# Altium project Visual_tactile.PrjPcb (part 1 of 3)
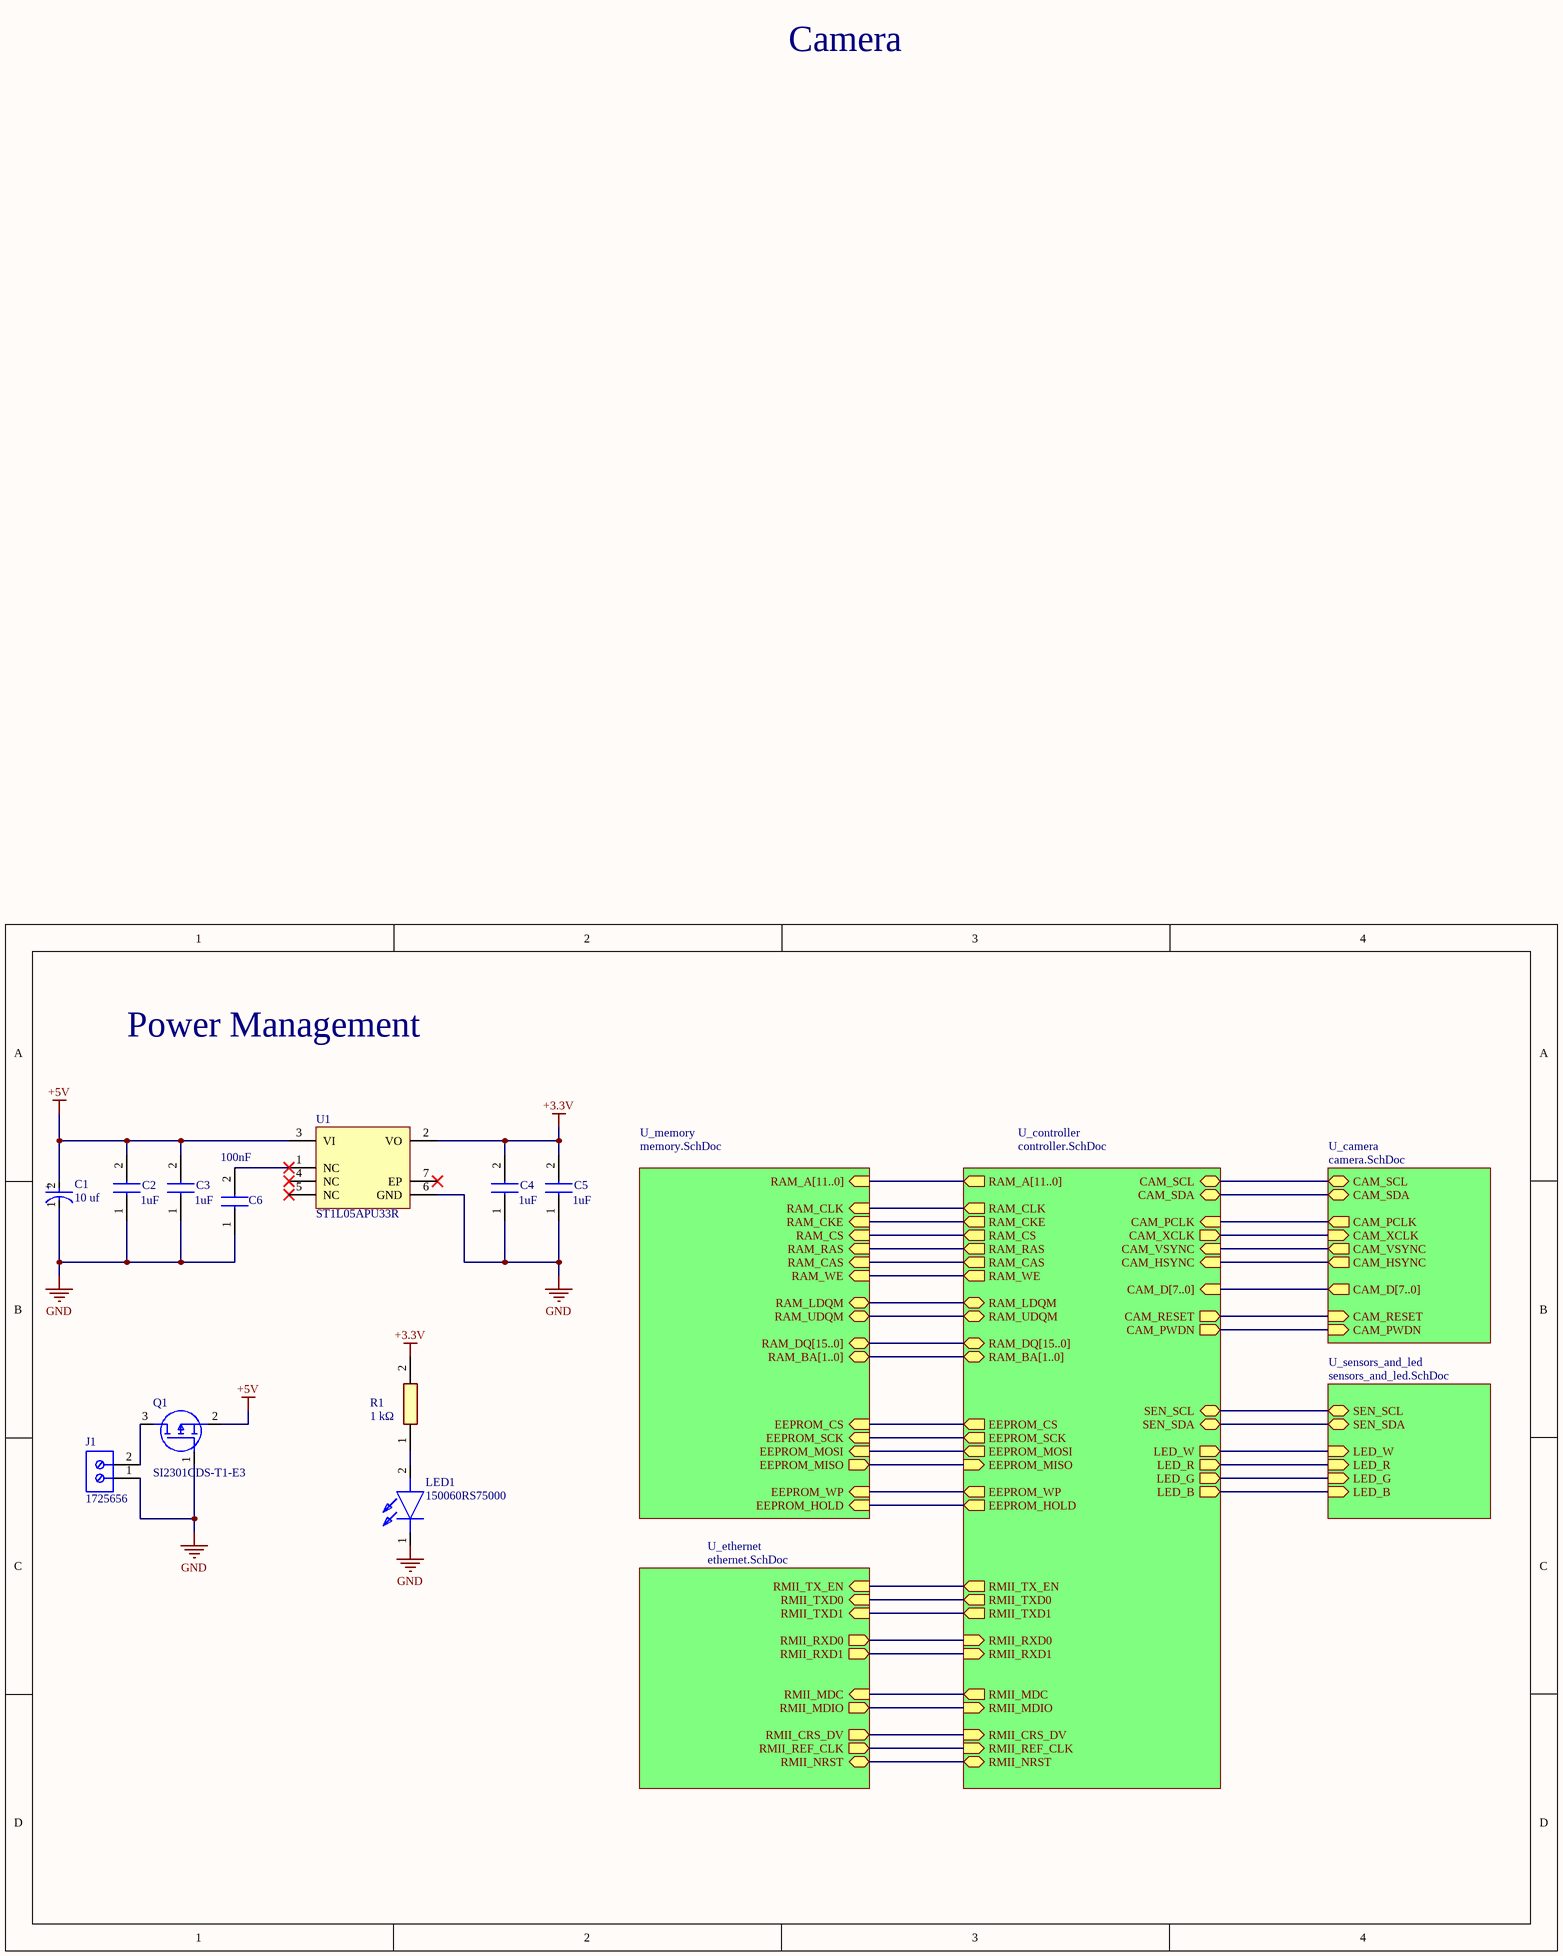
[diagram p0: visual_tactile.SchDoc]
6 sheets, 169 parts. Net scope: hierarchical (ports join the sheet entries above them; power ports are global).
Board file: visual_tactile.PcbDoc
Sheets:
  visual_tactile.SchDoc
    U_controller = controller.SchDoc
    U_ethernet = ethernet.SchDoc
    U_camera = camera.SchDoc
    U_sensors_and_led = sensors_and_led.SchDoc
    U_memory = memory.SchDoc

## Sheet visual_tactile.SchDoc
size A4; SheetNumber: 1; SheetTotal: 6

### Parts
C1  10 uf  [FP-T491D-MFG]
C2  value 1uF  [CAPC1608X87N]
C3  value 1uF  [CAPC1608X87N]
C4  value 1uF  [CAPC1608X87N]
C5  value 1uF  [CAPC1608X87N]
C6  value 100nF  [CAPC1608X87N]  (hidden comment: CGA3E2X7R1H104K080AA)
J1  1725656  [PHOE-1725656-2]
LED1  150060RS75000  [LEDC1608X80N]
Q1  SI2301CDS-T1-E3  [SOT95P237X112-3N]
R1  1 kΩ  [RESC1005X35N]
U1  ST1L05APU33R  [DFN6D_M]

### Sub-sheets
U_camera = camera.SchDoc: CAM_SCL (bidir), CAM_SDA (bidir), CAM_RESET (in), CAM_PCLK (out), CAM_HSYNC (out), CAM_VSYNC (out), CAM_D[7..0] (out), CAM_XCLK (in), CAM_PWDN (in)
U_controller = controller.SchDoc: CAM_D[7..0] (in), CAM_PCLK (in), CAM_VSYNC (in), CAM_XCLK (out), CAM_HSYNC (in), CAM_SCL (bidir), CAM_SDA (bidir), CAM_RESET (out), CAM_PWDN (out), SEN_SCL (bidir), SEN_SDA (bidir), EEPROM_CS (out), EEPROM_SCK (out), EEPROM_MOSI (out), EEPROM_WP (out), EEPROM_HOLD (out), EEPROM_MISO (in), RAM_A[11..0] (out), RAM_DQ[15..0] (bidir), RAM_BA[1..0] (bidir), RAM_CLK (out), RAM_CKE (out), RAM_CS (out), RAM_RAS (out), RAM_CAS (out), RAM_WE (out), RAM_LDQM (bidir), RAM_UDQM (bidir), RMII_TX_EN (out), RMII_TXD0 (out), RMII_TXD1 (out), RMII_RXD0 (in), RMII_RXD1 (in), RMII_CRS_DV (in), RMII_MDC (out), RMII_MDIO (in), RMII_NRST (bidir), RMII_REF_CLK (in), LED_W (out), LED_R (out), LED_G (out), LED_B (out)
U_ethernet = ethernet.SchDoc: RMII_TX_EN (in), RMII_TXD0 (in), RMII_TXD1 (in), RMII_RXD0 (out), RMII_RXD1 (out), RMII_CRS_DV (out), RMII_MDC (in), RMII_MDIO (out), RMII_NRST (bidir), RMII_REF_CLK (out)
U_memory = memory.SchDoc: EEPROM_CS (in), EEPROM_SCK (in), EEPROM_MOSI (in), EEPROM_WP (in), EEPROM_HOLD (in), EEPROM_MISO (out), RAM_A[11..0] (in), RAM_DQ[15..0] (bidir), RAM_BA[1..0] (bidir), RAM_CLK (in), RAM_CKE (in), RAM_CS (in), RAM_RAS (in), RAM_CAS (in), RAM_WE (in), RAM_LDQM (bidir), RAM_UDQM (bidir)
U_sensors_and_led = sensors_and_led.SchDoc: SEN_SCL (bidir), SEN_SDA (bidir), LED_W (in), LED_R (in), LED_G (in), LED_B (in)

### Nets
+3.3V: C4.2 C5.2 R1.2 U1.2(VO)
+5V: C1.2(A) C2.2 C3.2 Q1.2(S) U1.3(VI)
GND: C1.1(C) C2.1 C3.1 C4.1 C5.1 C6.1 J1.1 LED1.1(K) Q1.1(G) U1.6(GND)
CAM_HSYNC: sheet U_controller/CAM_HSYNC, sheet U_camera/CAM_HSYNC
CAM_PCLK: sheet U_controller/CAM_PCLK, sheet U_camera/CAM_PCLK
CAM_PWDN: sheet U_controller/CAM_PWDN, sheet U_camera/CAM_PWDN
CAM_RESET: sheet U_controller/CAM_RESET, sheet U_camera/CAM_RESET
CAM_SCL: sheet U_controller/CAM_SCL, sheet U_camera/CAM_SCL
CAM_SDA: sheet U_controller/CAM_SDA, sheet U_camera/CAM_SDA
CAM_VSYNC: sheet U_controller/CAM_VSYNC, sheet U_camera/CAM_VSYNC
CAM_XCLK: sheet U_controller/CAM_XCLK, sheet U_camera/CAM_XCLK
EEPROM_CS: sheet U_controller/EEPROM_CS, sheet U_memory/EEPROM_CS
EEPROM_HOLD: sheet U_controller/EEPROM_HOLD, sheet U_memory/EEPROM_HOLD
EEPROM_MISO: sheet U_controller/EEPROM_MISO, sheet U_memory/EEPROM_MISO
EEPROM_MOSI: sheet U_controller/EEPROM_MOSI, sheet U_memory/EEPROM_MOSI
EEPROM_SCK: sheet U_controller/EEPROM_SCK, sheet U_memory/EEPROM_SCK
EEPROM_WP: sheet U_controller/EEPROM_WP, sheet U_memory/EEPROM_WP
NRST: sheet U_controller/RMII_NRST, sheet U_ethernet/RMII_NRST
RAM_CAS: sheet U_controller/RAM_CAS, sheet U_memory/RAM_CAS
RAM_CKE: sheet U_controller/RAM_CKE, sheet U_memory/RAM_CKE
RAM_CLK: sheet U_controller/RAM_CLK, sheet U_memory/RAM_CLK
RAM_CS: sheet U_controller/RAM_CS, sheet U_memory/RAM_CS
RAM_LDQM: sheet U_controller/RAM_LDQM, sheet U_memory/RAM_LDQM
RAM_RAS: sheet U_controller/RAM_RAS, sheet U_memory/RAM_RAS
RAM_UDQM: sheet U_controller/RAM_UDQM, sheet U_memory/RAM_UDQM
RAM_WE: sheet U_controller/RAM_WE, sheet U_memory/RAM_WE
RMII_CRS_DV: sheet U_controller/RMII_CRS_DV, sheet U_ethernet/RMII_CRS_DV
RMII_MDC: sheet U_controller/RMII_MDC, sheet U_ethernet/RMII_MDC
RMII_MDIO: sheet U_controller/RMII_MDIO, sheet U_ethernet/RMII_MDIO
RMII_REF_CLK: sheet U_controller/RMII_REF_CLK, sheet U_ethernet/RMII_REF_CLK
RMII_RXD0: sheet U_controller/RMII_RXD0, sheet U_ethernet/RMII_RXD0
RMII_RXD1: sheet U_controller/RMII_RXD1, sheet U_ethernet/RMII_RXD1
RMII_TX_EN: sheet U_controller/RMII_TX_EN, sheet U_ethernet/RMII_TX_EN
RMII_TXD0: sheet U_controller/RMII_TXD0, sheet U_ethernet/RMII_TXD0
RMII_TXD1: sheet U_controller/RMII_TXD1, sheet U_ethernet/RMII_TXD1
SEN_SCL: sheet U_controller/SEN_SCL, sheet U_sensors_and_led/SEN_SCL
SEN_SDA: sheet U_controller/SEN_SDA, sheet U_sensors_and_led/SEN_SDA
NetC6_2: C6.2 U1.1(NC)
NetJ1_2: J1.2 Q1.3(D)
NetLED1_2: LED1.2(A) R1.1
NetR41_1: sheet U_controller/LED_W, sheet U_sensors_and_led/LED_W
NetR42_1: sheet U_controller/LED_R, sheet U_sensors_and_led/LED_R
NetR43_1: sheet U_controller/LED_G, sheet U_sensors_and_led/LED_G
NetR44_1: sheet U_controller/LED_B, sheet U_sensors_and_led/LED_B

Not connected (* = marked no-connect by the designer): U1 4(NC)* 5(NC)* 7(EP)*

### Buses and harness runs
bus sheet U_camera/CAM_D[7..0] = sheet U_controller/CAM_D[7..0]
bus sheet U_controller/RAM_A[11..0] = sheet U_memory/RAM_A[11..0]
bus sheet U_controller/RAM_BA[1..0] = sheet U_memory/RAM_BA[1..0]
bus sheet U_controller/RAM_DQ[15..0] = sheet U_memory/RAM_DQ[15..0]

### Notes on the sheet
- Camera
- Power Management
- (in symbol CMP-2000-07200-2) +

### Library data of the parts
C1 = CMP-2000-07200-2: CAP TANT 10UF 10% 25V 2917; Tolerance: 20%; Life (Hours): 2000Hour; Dielectric Material: Tantalum; Dissipation Factor: 6%; Leakage Current: 2.5uA; Ripple Current: 387mA; Polarity: Polar; ESR (Equivalent Series Resistance): 1R; Voltage: 25V; Capacitance: 10uF; Voltage Rating: 25V; Voltage Rating (DC): 25V; Depth: 4.3mm; Mount: Surface Mount; Length: 7.3mm; Termination: SMD/SMT; Radiation Hardening: No; Max Operating Temperature: 125°C; REACH SVHC: No SVHC; Height: 2.8mm; Package Quantity: 1; Packaging: Tape and Reel; Case Code (Imperial): 2917; Width: 4.3mm; Min Operating Temperature: -55°C; Features: General Purpose; Case Code (Metric): 7343; Height - Seated (Max): 0.122inch; Number of Pins: 2; Lead Free: Lead Free; Case/Package: 2917
C2-C5 = C0603C300J5GACTU: Ceramic Capacitor, Multilayer, Ceramic, 10V, 10% +Tol, 10% -Tol, X5R, 15% TC, 1uF, Surface Mount, 0603; Manufacturer_Name: KEMET; Multilayer: Yes; Tolerance  (fill in as +-): 5%; Rated DC Voltage (URdc): 50V; Temperature Characteristics Code: C0G; Datasheet Link: https://content.kemet.com/datasheets/KEM_C1003_C0G_SMD.pdf; Height: 0.87mm; Manufacturer_Part_Number: C0603C300J5GACTU; Mouser Part Number: 80-C0603C300J5G; Mouser Price/Stock: https://www.mouser.co.uk/ProductDetail/KEMET/C0603C300J5GACTU?qs=KQYYlyH3z3RpeXhtJmCcMA%3D%3D; Arrow Part Number: C0603C300J5GACTU; Arrow Price/Stock: https://www.arrow.com/en/products/c0603c300j5gactu/kemet-corporation; Supplier: Mouser; Supplier Part Number: 80-C0603C300J5G; Manufacturer: KEMET; Manufacturer Part Number: C0603C300J5GACTU; RoHS: Yes; Category: Ceramic Capacitors; Stock: 135157; Pricing: 1=0.1, 10=0.032, 50=0.032, 100=0.016, 1000=0.011, 10000=0.008 (USD); Mounting Technology: Surface Mount; Pins: 2; Dielectric Material: Ceramic; Package Shape: Rectangular; Case/Package: 0603; Terminal Finish: Nickel; Min Operating Temperature: -55°C; Max Operating Temperature: 125°C; JESD-609 Code: e3; Capacitor Type: Ceramic; Package Style: SMTMeter; Packaging: Tape and Reel; Tolerance (fill in as +-): 5%; Termination: Wraparound; Length: 1.6mm; Width: 0.8mm; Reach SVHC Compliant: Yes; RoHS Compliant: Yes; ComponentLink1URL: https://datasheet.ciiva.com:443/pdfs/VipMasterIC/IC/KEME/KEME-S-A0005605168/KEME-S-A0005605168-1.pdf?src-supplier=IHS+Markit; ComponentLink1Description: https://datasheet.ciiva.com:443/pdfs/VipMasterIC/IC/KEME/KEME-S-A0005605168/KEME-S-A0005605168-1.pdf?src-supplier=IHS+Markit; ComponentLink2URL: https://datasheet.ciiva.com/22700/1691965-22700853.pdf?src-supplier=Element14; ComponentLink2Description: https://datasheet.ciiva.com/22700/1691965-22700853.pdf?src-supplier=Element14; ComponentLink3URL: https://datasheet.ciiva.com/5420/kem-c1003-c0g-smd-356956-5420875.pdf?src-supplier=Mouser; ComponentLink3Description: https://datasheet.ciiva.com/5420/kem-c1003-c0g-smd-356956-5420875.pdf?src-supplier=Mouser; ComponentLink4URL: https://datasheet.ciiva.com:443/pdfs/VipMasterIC/IC/TDKC/TDKC-S-A0008796792/TDKC-S-A0008796792-1.pdf?src-supplier=IHS+Markit; ComponentLink4Description: https://datasheet.ciiva.com:443/pdfs/VipMasterIC/IC/TDKC/TDKC-S-A0008796792/TDKC-S-A0008796792-1.pdf?src-supplier=IHS+Markit; ComponentLink5URL: https://datasheet.ciiva.com:443/pdfs/VipMasterIC/IC/KEME/KEME-S-A0008991665/KEME-S-A0008991665-1.pdf?src-supplier=IHS+Markit; ComponentLink5Description: https://datasheet.ciiva.com:443/pdfs/VipMasterIC/IC/KEME/KEME-S-A0008991665/KEME-S-A0008991665-1.pdf?src-supplier=IHS+Markit
C6 = C0603C300J5GACTU: Ceramic Capacitor, Multilayer, Ceramic, 50V, 10% +Tol, 10% -Tol, X7R, 15% TC, 0.1uF, Surface Mount, 0603; Manufacturer_Name: KEMET; Manufacturer: TDK; Multilayer: Yes; Reference Standard: AEC-Q200; Datasheet Link: https://content.kemet.com/datasheets/KEM_C1003_C0G_SMD.pdf; Height: 0.87mm; Manufacturer_Part_Number: C0603C300J5GACTU; Mouser Part Number: 80-C0603C300J5G; Mouser Price/Stock: https://www.mouser.co.uk/ProductDetail/KEMET/C0603C300J5GACTU?qs=KQYYlyH3z3RpeXhtJmCcMA%3D%3D; Arrow Part Number: C0603C300J5GACTU; Arrow Price/Stock: https://www.arrow.com/en/products/c0603c300j5gactu/kemet-corporation; Supplier: Rs; Supplier Part Number: 7882985P; Manufacturer Part Number: CGA3E2X7R1H104K080AA; RoHS: Yes; Category: Ceramic Capacitors; Stock: 84850; Pricing: 250=0.042, 500=0.039, 1000=0.037, 2500=0.033 (EUR); Mounting Technology: Surface Mount; Pins: 2; Dielectric Material: Ceramic; Package Shape: Rectangular; Case/Package: 0603; Terminal Finish: Nickel; Min Operating Temperature: -55°C; Max Operating Temperature: 125°C; JESD-609 Code: e3; Capacitor Type: Ceramic; Tolerance  (fill in as +-): 10%; Package Style: SMTMeter; Packaging: Tape and Reel; Tolerance (fill in as +-): 10%; Rated DC Voltage (URdc): 50V; Temperature Characteristics Code: X7R; Termination: Wraparound; Length: 1.6mm; Width: 0.8mm; Reach SVHC Compliant: Yes; RoHS Compliant: Yes; ComponentLink1URL: https://datasheet.ciiva.com:443/pdfs/VipMasterIC/IC/TDKC/TDKC-S-A0008953915/TDKC-S-A0008953915-1.pdf?src-supplier=IHS+Markit; ComponentLink1Description: https://datasheet.ciiva.com:443/pdfs/VipMasterIC/IC/TDKC/TDKC-S-A0008953915/TDKC-S-A0008953915-1.pdf?src-supplier=IHS+Markit
J1 = CMP-2000-05299-1: Male Header, Pitch 2.54 mm, 1 x 2 Position, Height 9 mm, Tail Length 3.5 mm; Manufacturer: Phoenix Contact; Number of contacts: 2; Content: 250pc(s); Pitch: 2.54mm; Industrial packaging: Yes; Colour: Green; Manufacturer part No.: 1725656; Type: MPT0,5/2-2,54; Datasheet URL: http://datasheet.octopart.com/1725656-Phoenix-Contact-datasheet-5302866.pdf; Manufacturer URL: http://www.phoenixcontact.com/; Datasheet Version: Apr-08
LED1 = 150060RS75000: LED; Manufacturer_Name: Wurth Elektronik; Datasheet Link: http://katalog.we-online.de/led/datasheet/150060RS75000.pdf; Height: 0.8mm; Manufacturer_Part_Number: 150060RS75000; Mouser Part Number: 710-150060RS75000; Mouser Price/Stock: https://www.mouser.co.uk/ProductDetail/Wurth-Elektronik/150060RS75000?qs=LlUlMxKIyB3QnmZ3fw%2FVCA%3D%3D
Q1 = SI2301CDS-T1-E3: MOSFET (P-Channel); Manufacturer_Name: Vishay; Datasheet Link: https://componentsearchengine.com/Datasheets/2/SI2301CDS-T1-E3.pdf; Height: 1.12mm; Manufacturer_Part_Number: SI2301CDS-T1-E3; Mouser Part Number: 781-SI2301CDS-E3; Mouser Price/Stock: https://www.mouser.co.uk/ProductDetail/Vishay-Semiconductors/SI2301CDS-T1-E3?qs=45wPT2wjtGkQH%252ByrbRpz4Q%3D%3D; Arrow Part Number: SI2301CDS-T1-E3; Arrow Price/Stock: https://www.arrow.com/en/products/si2301cds-t1-e3/vishay?region=nac
R1 = CPF0402B100KE: Resistor; Manufacturer_Name: TE Connectivity; Datasheet Link: http://www.farnell.com/datasheets/1786775.pdf; Height: 0.35mm; Manufacturer_Part_Number: CPF0402B100KE; Mouser Part Number: 279-CPF0402B100KE; Mouser Price/Stock: https://www.mouser.co.uk/ProductDetail/TE-Connectivity-Holsworthy/CPF0402B100KE?qs=CXI0wBT1M2h4W2Gm72yIGA%3D%3D; Arrow Part Number: CPF0402B100KE; Arrow Price/Stock: https://www.arrow.com/en/products/cpf0402b100ke/te-connectivity?region=nac
U1 = CMP-0244-00290-1: Very Low Quiescent BiCMOS Voltage Regulator, 3.3V, 6-Pin VFDFPN, Tape and Reel; ComponentLink2Description: Datasheet; PackageDescription: 6-Pin Plastic, Dual LLP, 3 x 3 mm Body, 0.95 mm Pitch, Exposed Pad; DatasheetVersion: 1/09/2009; ComponentLink1URL: http://www.st.com; ComponentLink1Description: Manufacturer URL; PackageVersion: 2008; ComponentLink2URL: http://www.st.com/internet/com/TECHNICAL_RESOURCES/TECHNICAL_LITERATURE/DATASHEET/CD00186925.pdf; PackageReference: DFN6D

## Sheet controller.SchDoc
size A4; SheetNumber: 2; SheetTotal: 6
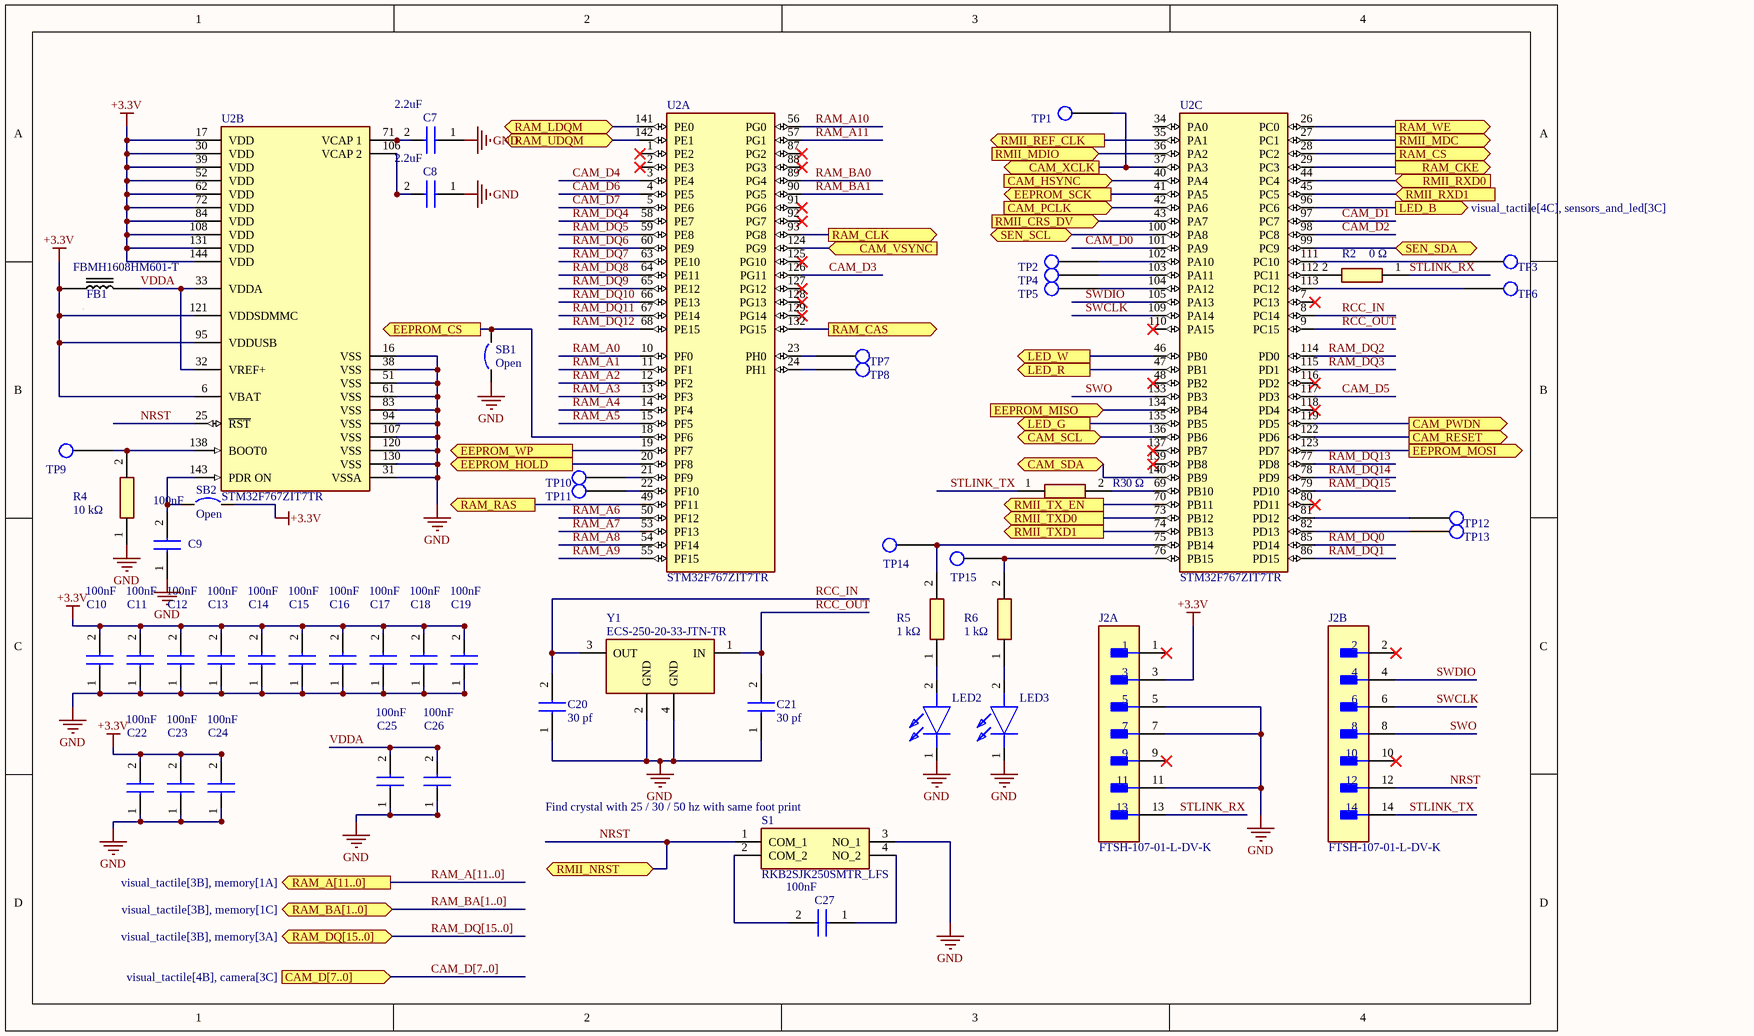
[diagram p1: controller.SchDoc]

### Parts
C7  value 2.2uF  [CAPC1608X87N]  (hidden comment: 06036C225KAT2A)
C8  value 2.2uF  [CAPC1608X87N]  (hidden comment: 06036C225KAT2A)
C9  value 100nF  [CAPC1608X87N]  (hidden comment: CGA3E2X7R1H104K080AA)
C10  value 100nF  [CAPC1608X87N]  (hidden comment: CGA3E2X7R1H104K080AA)
C11  value 100nF  [CAPC1608X87N]  (hidden comment: CGA3E2X7R1H104K080AA)
C12  value 100nF  [CAPC1608X87N]  (hidden comment: CGA3E2X7R1H104K080AA)
C13  value 100nF  [CAPC1608X87N]  (hidden comment: CGA3E2X7R1H104K080AA)
C14  value 100nF  [CAPC1608X87N]  (hidden comment: CGA3E2X7R1H104K080AA)
C15  value 100nF  [CAPC1608X87N]  (hidden comment: CGA3E2X7R1H104K080AA)
C16  value 100nF  [CAPC1608X87N]  (hidden comment: CGA3E2X7R1H104K080AA)
C17  value 100nF  [CAPC1608X87N]  (hidden comment: CGA3E2X7R1H104K080AA)
C18  value 100nF  [CAPC1608X87N]  (hidden comment: CGA3E2X7R1H104K080AA)
C19  value 100nF  [CAPC1608X87N]  (hidden comment: CGA3E2X7R1H104K080AA)
C20  30 pf  [CAPC1608X87N]
C21  30 pf  [CAPC1608X87N]
C22  value 100nF  [CAPC1608X87N]  (hidden comment: CGA3E2X7R1H104K080AA)
C23  value 100nF  [CAPC1608X87N]  (hidden comment: CGA3E2X7R1H104K080AA)
C24  value 100nF  [CAPC1608X87N]  (hidden comment: CGA3E2X7R1H104K080AA)
C25  value 100nF  [CAPC1608X87N]  (hidden comment: CGA3E2X7R1H104K080AA)
C26  value 100nF  [CAPC1608X87N]  (hidden comment: CGA3E2X7R1H104K080AA)
C27  value 100nF  [CAPC1608X87N]  (hidden comment: CGA3E2X7R1H104K080AA)
FB1  FBMH1608HM601-T  [BEADC1608X90N]
J2  FTSH-107-01-L-DV-K  [FP-FTSH-107-01-L-DV-K-MFG]  (parts A,B of 2)
LED2  150060RS75000  [LEDC1608X80N]  (value not drawn)
LED3  150060RS75000  [LEDC1608X80N]  (value not drawn)
R2  0 Ω  [RESC1005X35N]
R3  0 Ω  [RESC1005X35N]
R4  10 kΩ  [RESC1005X35N]
R5  1 kΩ  [RESC1005X35N]
R6  1 kΩ  [RESC1005X35N]
S1  RKB2SJK250SMTR_LFS  [RKB2SJK250SMTRLFS]
SB1  Open  [SB_0603]
SB2  Open  [SB_0603]
TP1  Test point  [test point]  (value not drawn)
TP2  Test point  [test point]  (value not drawn)
TP3  Test point  [test point]  (value not drawn)
TP4  Test point  [test point]  (value not drawn)
TP5  Test point  [test point]  (value not drawn)
TP6  Test point  [test point]  (value not drawn)
TP7  Test point  [test point]  (value not drawn)
TP8  Test point  [test point]  (value not drawn)
TP9  Test point  [test point]  (value not drawn)
TP10  Test point  [test point]  (value not drawn)
TP11  Test point  [test point]  (value not drawn)
TP12  Test point  [test point]  (value not drawn)
TP13  Test point  [test point]  (value not drawn)
TP14  Test point  [test point]  (value not drawn)
TP15  Test point  [test point]  (value not drawn)
U2  STM32F767ZIT7TR  [FP-LQFP144-1A-MFG]  (parts A,B,C of 3)
Y1  ECS-250-20-33-JTN-TR  [ECS-250-20-33-JTN-TR]

### Ports
CAM_D[7..0] (in, see visual_tactile[4B], camera[3C]), CAM_HSYNC (in, see visual_tactile[4B], camera[3B]), CAM_PCLK (in, see visual_tactile[4B], camera[3B]), CAM_PWDN (out, see visual_tactile[4B], camera[1C]), CAM_RESET (out, see visual_tactile[4B], camera[1C]), CAM_SCL (bidir, see visual_tactile[4B], camera[1C]), CAM_SDA (bidir, see visual_tactile[4B], camera[1C]), CAM_VSYNC (in, see visual_tactile[4B], camera[3B]), CAM_XCLK (out, see visual_tactile[4B], camera[1C]), EEPROM_CS (out, see visual_tactile[3B], memory[1D]), EEPROM_HOLD (out, see visual_tactile[3C], memory[1D]), EEPROM_MISO (in, see visual_tactile[3C], memory[3D]), EEPROM_MOSI (out, see visual_tactile[3C], memory[1D]), EEPROM_SCK (out, see visual_tactile[3C], memory[1D]), EEPROM_WP (out, see visual_tactile[3C], memory[1D]), LED_B (out, see visual_tactile[4C], sensors_and_led[3C]), LED_G (out, see visual_tactile[4C], sensors_and_led[2C]), LED_R (out, see visual_tactile[4C], sensors_and_led[2C]), LED_W (out, see visual_tactile[4C], sensors_and_led[1C]), RAM_A[11..0] (out, see visual_tactile[3B], memory[1A]), RAM_BA[1..0] (bidir, see visual_tactile[3B], memory[1C]), RAM_CAS (out, see visual_tactile[3B], memory[2C]), RAM_CKE (out, see visual_tactile[3B], memory[2B]), RAM_CLK (out, see visual_tactile[3B], memory[2B]), RAM_CS (out, see visual_tactile[3B], memory[2B]), RAM_DQ[15..0] (bidir, see visual_tactile[3B], memory[3A]), RAM_LDQM (bidir, see visual_tactile[3B], memory[3C]), RAM_RAS (out, see visual_tactile[3B], memory[2B]), RAM_UDQM (bidir, see visual_tactile[3B], memory[3C]), RAM_WE (out, see visual_tactile[3B], memory[2C]), RMII_CRS_DV (in, see visual_tactile[3D], ethernet[1B]), RMII_MDC (out, see visual_tactile[3D], ethernet[1B]), RMII_MDIO (in, see visual_tactile[3D], ethernet[1B]), RMII_NRST (bidir, see visual_tactile[3D], ethernet[1B]), RMII_REF_CLK (out, see visual_tactile[3D], ethernet[1B]), RMII_RXD0 (in, see visual_tactile[3C], ethernet[1B]), RMII_RXD1 (in, see visual_tactile[3C], ethernet[1B]), RMII_TX_EN (out, see visual_tactile[3C], ethernet[1B]), RMII_TXD0 (out, see visual_tactile[3C], ethernet[1B]), RMII_TXD1 (out, see visual_tactile[3C], ethernet[1B]), SEN_SCL (bidir, see visual_tactile[4B], sensors_and_led[1A]), SEN_SDA (bidir, see visual_tactile[4B], sensors_and_led[1B])

### Nets
+3.3V: C10.2 C11.2 C12.2 C13.2 C14.2 C15.2 C16.2 C17.2 C18.2 C19.2 C22.2 C23.2 C24.2 FB1.1 J2.3 SB2.2 U2.6(VBAT) U2.17(VDD) U2.30(VDD) U2.39(VDD) U2.52(VDD) U2.62(VDD) U2.72(VDD) U2.84(VDD) U2.95(VDDUSB) U2.108(VDD) U2.121(VDDSDMMC) U2.131(VDD) U2.144(VDD)
GND: C7.1 C8.1 C9.1 C10.1 C11.1 C12.1 C13.1 C14.1 C15.1 C16.1 C17.1 C18.1 C19.1 C20.1 C21.1 C22.1 C23.1 C24.1 C25.1 C26.1 J2.5 J2.7 J2.11 LED2.1(K) LED3.1(K) R4.1 S1.3(NO_1) SB1.1 U2.16(VSS) U2.31(VSSA) U2.38(VSS) U2.51(VSS) U2.61(VSS) U2.83(VSS) U2.94(VSS) U2.107(VSS) U2.120(VSS) U2.130(VSS) Y1.2(GND) Y1.4(GND)
CAM_D0: U2.101(PA9)
CAM_D1: U2.97(PC7)
CAM_D2: U2.98(PC8)
CAM_D3: U2.126(PG11)
CAM_D4: U2.3(PE4)
CAM_D5: U2.117(PD3)
CAM_D6: U2.4(PE5)
CAM_D7: U2.5(PE6)
CAM_HSYNC: U2.40(PA4) ; port CAM_HSYNC
CAM_PCLK: U2.42(PA6) ; port CAM_PCLK
CAM_PWDN: U2.119(PD5) ; port CAM_PWDN
CAM_RESET: U2.122(PD6) ; port CAM_RESET
CAM_SCL: U2.136(PB6) ; port CAM_SCL
CAM_SDA: U2.140(PB9) ; port CAM_SDA
CAM_VSYNC: U2.124(PG9) ; port CAM_VSYNC
CAM_XCLK: TP1.1 U2.37(PA3) ; port CAM_XCLK
EEPROM_CS: SB1.2 U2.18(PF6) ; port EEPROM_CS
EEPROM_HOLD: U2.20(PF8) ; port EEPROM_HOLD
EEPROM_MISO: U2.134(PB4) ; port EEPROM_MISO
EEPROM_MOSI: U2.123(PD7) ; port EEPROM_MOSI
EEPROM_SCK: U2.41(PA5) ; port EEPROM_SCK
EEPROM_WP: U2.19(PF7) ; port EEPROM_WP
NRST: J2.12 S1.1(COM_1) U2.25(~{RST}) ; port RMII_NRST
RAM_A0: U2.10(PF0)
RAM_A1: U2.11(PF1)
RAM_A2: U2.12(PF2)
RAM_A3: U2.13(PF3)
RAM_A4: U2.14(PF4)
RAM_A5: U2.15(PF5)
RAM_A6: U2.50(PF12)
RAM_A7: U2.53(PF13)
RAM_A8: U2.54(PF14)
RAM_A9: U2.55(PF15)
RAM_A10: U2.56(PG0)
RAM_A11: U2.57(PG1)
RAM_BA0: U2.89(PG4)
RAM_BA1: U2.90(PG5)
RAM_CAS: U2.132(PG15) ; port RAM_CAS
RAM_CKE: U2.29(PC3) ; port RAM_CKE
RAM_CLK: U2.93(PG8) ; port RAM_CLK
RAM_CS: U2.28(PC2) ; port RAM_CS
RAM_DQ0: U2.85(PD14)
RAM_DQ1: U2.86(PD15)
RAM_DQ2: U2.114(PD0)
RAM_DQ3: U2.115(PD1)
RAM_DQ4: U2.58(PE7)
RAM_DQ5: U2.59(PE8)
RAM_DQ6: U2.60(PE9)
RAM_DQ7: U2.63(PE10)
RAM_DQ8: U2.64(PE11)
RAM_DQ9: U2.65(PE12)
RAM_DQ10: U2.66(PE13)
RAM_DQ11: U2.67(PE14)
RAM_DQ12: U2.68(PE15)
RAM_DQ13: U2.77(PD8)
RAM_DQ14: U2.78(PD9)
RAM_DQ15: U2.79(PD10)
RAM_LDQM: U2.141(PE0) ; port RAM_LDQM
RAM_RAS: U2.49(PF11) ; port RAM_RAS
RAM_UDQM: U2.142(PE1) ; port RAM_UDQM
RAM_WE: U2.26(PC0) ; port RAM_WE
RCC_IN: C20.2 U2.8(PC14) Y1.3(OUT)
RCC_OUT: C21.2 U2.9(PC15) Y1.1(IN)
RMII_CRS_DV: U2.43(PA7) ; port RMII_CRS_DV
RMII_MDC: U2.27(PC1) ; port RMII_MDC
RMII_MDIO: U2.36(PA2) ; port RMII_MDIO
RMII_REF_CLK: U2.35(PA1) ; port RMII_REF_CLK
RMII_RXD0: U2.44(PC4) ; port RMII_RXD0
RMII_RXD1: U2.45(PC5) ; port RMII_RXD1
RMII_TX_EN: U2.70(PB11) ; port RMII_TX_EN
RMII_TXD0: U2.73(PB12) ; port RMII_TXD0
RMII_TXD1: U2.74(PB13) ; port RMII_TXD1
SEN_SCL: U2.100(PA8) ; port SEN_SCL
SEN_SDA: U2.99(PC9) ; port SEN_SDA
STLINK_RX: J2.13 R2.1
STLINK_TX: J2.14 R3.1
SWCLK: J2.6 U2.109(PA14)
SWDIO: J2.4 U2.105(PA13)
SWO: J2.8 U2.133(PB3)
VDDA: C25.2 C26.2 FB1.2 U2.32(VREF+) U2.33(VDDA)
NetC7_2: C7.2 U2.71(VCAP_1)
NetC8_2: C8.2 U2.106(VCAP_2)
NetC9_2: C9.2 SB2.1 U2.143(PDR_ON)
NetC27_1: C27.1 S1.4(NO_2)
NetC27_2: C27.2 S1.2(COM_2)
NetLED2_2: LED2.2(A) R5.1
NetLED3_2: LED3.2(A) R6.1
NetR2_2: R2.2 U2.112(PC11)
NetR3_2: R3.2 U2.69(PB10)
NetR4_2: R4.2 TP9.1 U2.138(BOOT0)
NetR5_2: R5.2 TP14.1 U2.75(PB14)
NetR6_2: R6.2 TP15.1 U2.76(PB15)
NetR41_1: U2.46(PB0) ; port LED_W
NetR42_1: U2.47(PB1) ; port LED_R
NetR43_1: U2.135(PB5) ; port LED_G
NetR44_1: U2.96(PC6) ; port LED_B
NetTP2_1: TP2.1 U2.102(PA10)
NetTP3_1: TP3.1 U2.111(PC10)
NetTP4_1: TP4.1 U2.103(PA11)
NetTP5_1: TP5.1 U2.104(PA12)
NetTP6_1: TP6.1 U2.113(PC12)
NetTP7_1: TP7.1 U2.23(PH0)
NetTP8_1: TP8.1 U2.24(PH1)
NetTP10_1: TP10.1 U2.21(PF9)
NetTP11_1: TP11.1 U2.22(PF10)
NetTP12_1: TP12.1 U2.81(PD12)
NetTP13_1: TP13.1 U2.82(PD13)

Not connected (* = marked no-connect by the designer): J2 1* 2* 9* 10*; U2 1(PE2)* 2(PE3)* 7(PC13)* 34(PA0) 48(PB2)* 80(PD11)* 87(PG2)* 88(PG3)* 91(PG6)* 92(PG7)* 110(PA15)* 116(PD2)* 118(PD4)* 125(PG10)* 127(PG12)* 128(PG13)* 129(PG14)* 137(PB7)* 139(PB8)*

### Buses and harness runs
bus CAM_D[7..0] = port CAM_D[7..0]
bus RAM_A[11..0] = port RAM_A[11..0]
bus RAM_BA[1..0] = port RAM_BA[1..0]
bus RAM_DQ[15..0] = port RAM_DQ[15..0]

### Notes on the sheet
- (near S1) Find crystal with 25 / 30 / 50 hz with same foot print

### Library data of the parts
C7 C8 = C0603C300J5GACTU: Ceramic Capacitor, Multilayer, Ceramic, 6.3V, 10% +Tol, 10% -Tol, X7R, 15% TC, 2.2uF, Surface Mount, 0603; Manufacturer_Name: KEMET; Manufacturer: Kyocera AVX; Multilayer: Yes; Datasheet Link: https://content.kemet.com/datasheets/KEM_C1003_C0G_SMD.pdf; Height: 0.87mm; Manufacturer_Part_Number: C0603C300J5GACTU; Mouser Part Number: 80-C0603C300J5G; Mouser Price/Stock: https://www.mouser.co.uk/ProductDetail/KEMET/C0603C300J5GACTU?qs=KQYYlyH3z3RpeXhtJmCcMA%3D%3D; Arrow Part Number: C0603C300J5GACTU; Arrow Price/Stock: https://www.arrow.com/en/products/c0603c300j5gactu/kemet-corporation; Supplier: Arrow Electronics; Supplier Part Number: 06036C225KAT2A; Manufacturer Part Number: 06036C225KAT2A; RoHS: Yes; Category: Ceramic Capacitors; Stock: 848000; Pricing: 4000=0.0297, 8000=0.0293 (USD); Mounting Technology: Surface Mount; Pins: 2; Dielectric Material: Ceramic; Package Shape: Rectangular; Case/Package: 0603; Terminal Finish: Nickel; Min Operating Temperature: -55°C; Max Operating Temperature: 125°C; Capacitor Type: Ceramic; Tolerance  (fill in as +-): 10%; Package Style: SMTMeter; Packaging: Tape and Reel; Tolerance (fill in as +-): 10%; Rated DC Voltage (URdc): 6.3V; Temperature Characteristics Code: X7R; Termination: Wraparound; JESD-609 Code: e3; Length: 1.6mm; Width: 0.81mm; Reach SVHC Compliant: Yes; RoHS Compliant: Yes; ComponentLink1URL: https://datasheet.ciiva.com:443/pdfs/VipMasterIC/IC/AVXC/AVXC-S-A0009640452/AVXC-S-A0009640452-1.pdf?src-supplier=IHS+Markit; ComponentLink1Description: https://datasheet.ciiva.com:443/pdfs/VipMasterIC/IC/AVXC/AVXC-S-A0009640452/AVXC-S-A0009640452-1.pdf?src-supplier=IHS+Markit
C9-C19 C22-C27 = C0603C300J5GACTU: as C6 on sheet visual_tactile; Datasheet Link: https://content.kemet.com/datasheets/KEM_C1003_C0G_SMD.pdf; Height: 0.87mm; Manufacturer_Part_Number: C0603C300J5GACTU; Mouser Part Number: 80-C0603C300J5G; Mouser Price/Stock: https://www.mouser.co.uk/ProductDetail/KEMET/C0603C300J5GACTU?qs=KQYYlyH3z3RpeXhtJmCcMA%3D%3D; Arrow Part Number: C0603C300J5GACTU; Arrow Price/Stock: https://www.arrow.com/en/products/c0603c300j5gactu/kemet-corporation; Supplier: Rs; Supplier Part Number: 7882985P; Manufacturer Part Number: CGA3E2X7R1H104K080AA; RoHS: Yes; Category: Ceramic Capacitors; Stock: 84850; Pricing: 250=0.042, 500=0.039, 1000=0.037, 2500=0.033 (EUR); Mounting Technology: Surface Mount; Pins: 2; Dielectric Material: Ceramic; Package Shape: Rectangular; Case/Package: 0603; Terminal Finish: Nickel; Min Operating Temperature: -55°C; Max Operating Temperature: 125°C; JESD-609 Code: e3; Capacitor Type: Ceramic; Tolerance  (fill in as +-): 10%; Package Style: SMTMeter; Packaging: Tape and Reel; Tolerance (fill in as +-): 10%; Rated DC Voltage (URdc): 50V; Temperature Characteristics Code: X7R; Termination: Wraparound; Length: 1.6mm; Width: 0.8mm; Reach SVHC Compliant: Yes; RoHS Compliant: Yes; ComponentLink1URL: https://datasheet.ciiva.com:443/pdfs/VipMasterIC/IC/TDKC/TDKC-S-A0008953915/TDKC-S-A0008953915-1.pdf?src-supplier=IHS+Markit; ComponentLink1Description: https://datasheet.ciiva.com:443/pdfs/VipMasterIC/IC/TDKC/TDKC-S-A0008953915/TDKC-S-A0008953915-1.pdf?src-supplier=IHS+Markit
C20 C21 = C0603C300J5GACTU: Ceramic Capacitor, Multilayer, Ceramic, 50V, 5% +Tol, 5% -Tol, C0G, 30ppm/Cel TC, 0.00003uF, Surface Mount, 0603; Manufacturer_Name: KEMET; Value: 30pF; Multilayer: Yes; Datasheet Link: https://content.kemet.com/datasheets/KEM_C1003_C0G_SMD.pdf; Height: 0.87mm; Manufacturer_Part_Number: C0603C300J5GACTU; Mouser Part Number: 80-C0603C300J5G; Mouser Price/Stock: https://www.mouser.co.uk/ProductDetail/KEMET/C0603C300J5GACTU?qs=KQYYlyH3z3RpeXhtJmCcMA%3D%3D; Arrow Part Number: C0603C300J5GACTU; Arrow Price/Stock: https://www.arrow.com/en/products/c0603c300j5gactu/kemet-corporation; Supplier: Mouser; Supplier Part Number: 80-C0603C300J5G; Manufacturer: KEMET; Manufacturer Part Number: C0603C300J5GACTU; RoHS: Yes; Category: Ceramic Capacitors; Stock: 135157; Pricing: 1=0.1, 10=0.032, 50=0.032, 100=0.016, 1000=0.011, 10000=0.008 (USD); Mounting Technology: Surface Mount; Pins: 2; Dielectric Material: Ceramic; Package Shape: Rectangular; Case/Package: 0603; Terminal Finish: Nickel; Min Operating Temperature: -55°C; Max Operating Temperature: 125°C; JESD-609 Code: e3; Capacitor Type: Ceramic; Tolerance  (fill in as +-): 5%; Package Style: SMTMeter; Packaging: Tape and Reel; Tolerance (fill in as +-): 5%; Rated DC Voltage (URdc): 50V; Temperature Characteristics Code: C0G; Termination: Wraparound; Length: 1.6mm; Width: 0.8mm; Reach SVHC Compliant: Yes; RoHS Compliant: Yes; ComponentLink1URL: https://datasheet.ciiva.com:443/pdfs/VipMasterIC/IC/KEME/KEME-S-A0005605168/KEME-S-A0005605168-1.pdf?src-supplier=IHS+Markit; ComponentLink1Description: https://datasheet.ciiva.com:443/pdfs/VipMasterIC/IC/KEME/KEME-S-A0005605168/KEME-S-A0005605168-1.pdf?src-supplier=IHS+Markit; ComponentLink2URL: https://datasheet.ciiva.com/22700/1691965-22700853.pdf?src-supplier=Element14; ComponentLink2Description: https://datasheet.ciiva.com/22700/1691965-22700853.pdf?src-supplier=Element14; ComponentLink3URL: https://datasheet.ciiva.com/5420/kem-c1003-c0g-smd-356956-5420875.pdf?src-supplier=Mouser; ComponentLink3Description: https://datasheet.ciiva.com/5420/kem-c1003-c0g-smd-356956-5420875.pdf?src-supplier=Mouser
FB1 = FBMH1608HM601-T: Ferrite Bead; Manufacturer_Name: TAIYO YUDEN; Datasheet Link: https://componentsearchengine.com/Datasheets/2/FBMH1608HM601-T.pdf; Height: 0.9mm; Manufacturer_Part_Number: FBMH1608HM601-T; Mouser Part Number: 963-FBMH1608HM601-T; Mouser Price/Stock: https://www.mouser.co.uk/ProductDetail/Taiyo-Yuden/FBMH1608HM601-T?qs=I6KAKw0tg2y6O4cu0afp%252BA%3D%3D; Arrow Part Number: FBMH1608HM601-T; Arrow Price/Stock: https://www.arrow.com/en/products/fbmh1608hm601-t/taiyo-yuden
J2 = CMP-02766-001412-1: CONN HEADER SMD 14POS 1.27MM; Number of Contacts: 14; Gender: Male; Termination: Solder; Lead Free: Lead Free; Depth: 5.84mm; Min Operating Temperature: -55°C; Length: 8.89mm; RoHS Compliant: Yes; Housing Material: Polymer; Housing Color: Black; Max Operating Temperature: 125°C; Number of Rows: 2; Pitch: 1.27mm; Radiation Hardening: No; Orientation: Straight; Packaging: Rail/Tube; Contact Material: Bronze; Contact Plating: Gold
LED2 LED3 = 150060RS75000: LED; Manufacturer_Name: Wurth Elektronik; Datasheet Link: http://katalog.we-online.de/led/datasheet/150060RS75000.pdf; Height: 0.8mm; Manufacturer_Part_Number: 150060RS75000; Mouser Part Number: 710-150060RS75000; Mouser Price/Stock: https://www.mouser.co.uk/ProductDetail/Wurth-Elektronik/150060RS75000?qs=LlUlMxKIyB3QnmZ3fw%2FVCA%3D%3D
R2-R6 = CPF0402B100KE: as R1 on sheet visual_tactile; Datasheet Link: http://www.farnell.com/datasheets/1786775.pdf; Height: 0.35mm; Manufacturer_Part_Number: CPF0402B100KE; Mouser Part Number: 279-CPF0402B100KE; Mouser Price/Stock: https://www.mouser.co.uk/ProductDetail/TE-Connectivity-Holsworthy/CPF0402B100KE?qs=CXI0wBT1M2h4W2Gm72yIGA%3D%3D; Arrow Part Number: CPF0402B100KE; Arrow Price/Stock: https://www.arrow.com/en/products/cpf0402b100ke/te-connectivity?region=nac
S1 = RKB2SJK250SMTR_LFS: Switch; Manufacturer_Name: C & K COMPONENTS; Manufacturer_Part_Number: RKB2SJK250SMTR LFS; Datasheet Link: https://www.ckswitches.com/media/3130/ck_rk_datasheet.pdf; Height: 2.7mm; Mouser Part Number: 611-RKB2SJK250SMTRLF; Mouser Price/Stock: https://www.mouser.co.uk/ProductDetail/CK/RKB2SJK250SMTR-LFS?qs=iLbezkQI%252BsjlTHT7lSJp%2Fw%3D%3D; Arrow Part Number: RKB2SJK250SMTR LFS; Arrow Price/Stock: https://www.arrow.com/en/products/rkb2sjk250smtr-lfs/ck?region=europe
SB1 SB2 = Circuit Breaker: Published: 24-Mar-1999; Revision: July-2002: Re-released for DXP Platform.; Publisher: Altium Limited
U2 = CMP-12105-000028-1: ARM® Cortex®-M7 STM32F7 Microcontroller IC 32-Bit 216MHz 2MB (2M x 8) FLASH 144-LQFP (20x20); Manufacturer: STMicroelectronics; Standoff Height: 0.05mm; Number Of A/D Converters: 3; Ram Size: 512KBytes; Number Of Uart Channels: 8; Number Of Cores: 1; Max Junction Temp: +125°C; Number Of I/Os: 114; Core Architecture: ARM Cortex-M7; Number Of Spi Channels: 6; Interface: I2C,SPI,UART,USART,CAN,USB,LIN,IrDA,I2S,SMBus,Other; Max Supply Voltage: 3.6V; Number Of Adc Channels: 24; Memory Size: 2048KBytes; Min Supply Voltage: 1.65V; Number Of I2C Channels: 4; Number Of Timers/Counters: 15; Data Bus Width: 32bits; Temperature Range Low: -40°C; Category: IC; Memory Type: FLASH; Ambient Temperature Range Low: -40°C; RoHS: TRUE; ComponentLink2URL: https://www.st.com/resource/en/datasheet/stm32f767zi.pdf; Frequency: 216MHz; Temperature Range High: +125°C; Temperature: -40°C to +125°C; Manufacturer Part Number: STM32F767ZIT7TR; Package: LQFP144-1A; Number Of Usb Channels: 1; Device Class L1: Integrated Circuits (ICs); Octopart: https://octopart.com/stm32f767zit7tr-stmicroelectronics-104904785; Device Class L3: Microcontrollers; Ambient Temperature Range High: +105°C; ComponentLink2Description: Datasheet; Automotive: No; Lead Free: Yes; Device Class L2: Embedded Processors and Controllers; Height: 1.6mm
Y1 = ECS-250-20-33-JTN-TR: Crystal or Oscillator; Manufacturer_Name: RALTRON; Manufacturer_Part_Number: CO4605-100.000-T-TR; Datasheet Link: http://www.raltron.com//wp-content/uploads/2018/12/clock_co43_46_Series-updated.pdf; Height: 1.8mm